# Altium schematic sheet MCU.SchDoc: MK1 MCU
size A3; Author: Mikkel Nielsen; DrawnBy: Mikkel Nielsen; Engineer: Mikkel Nielsen; SheetNumber: 2; SheetTotal: 7
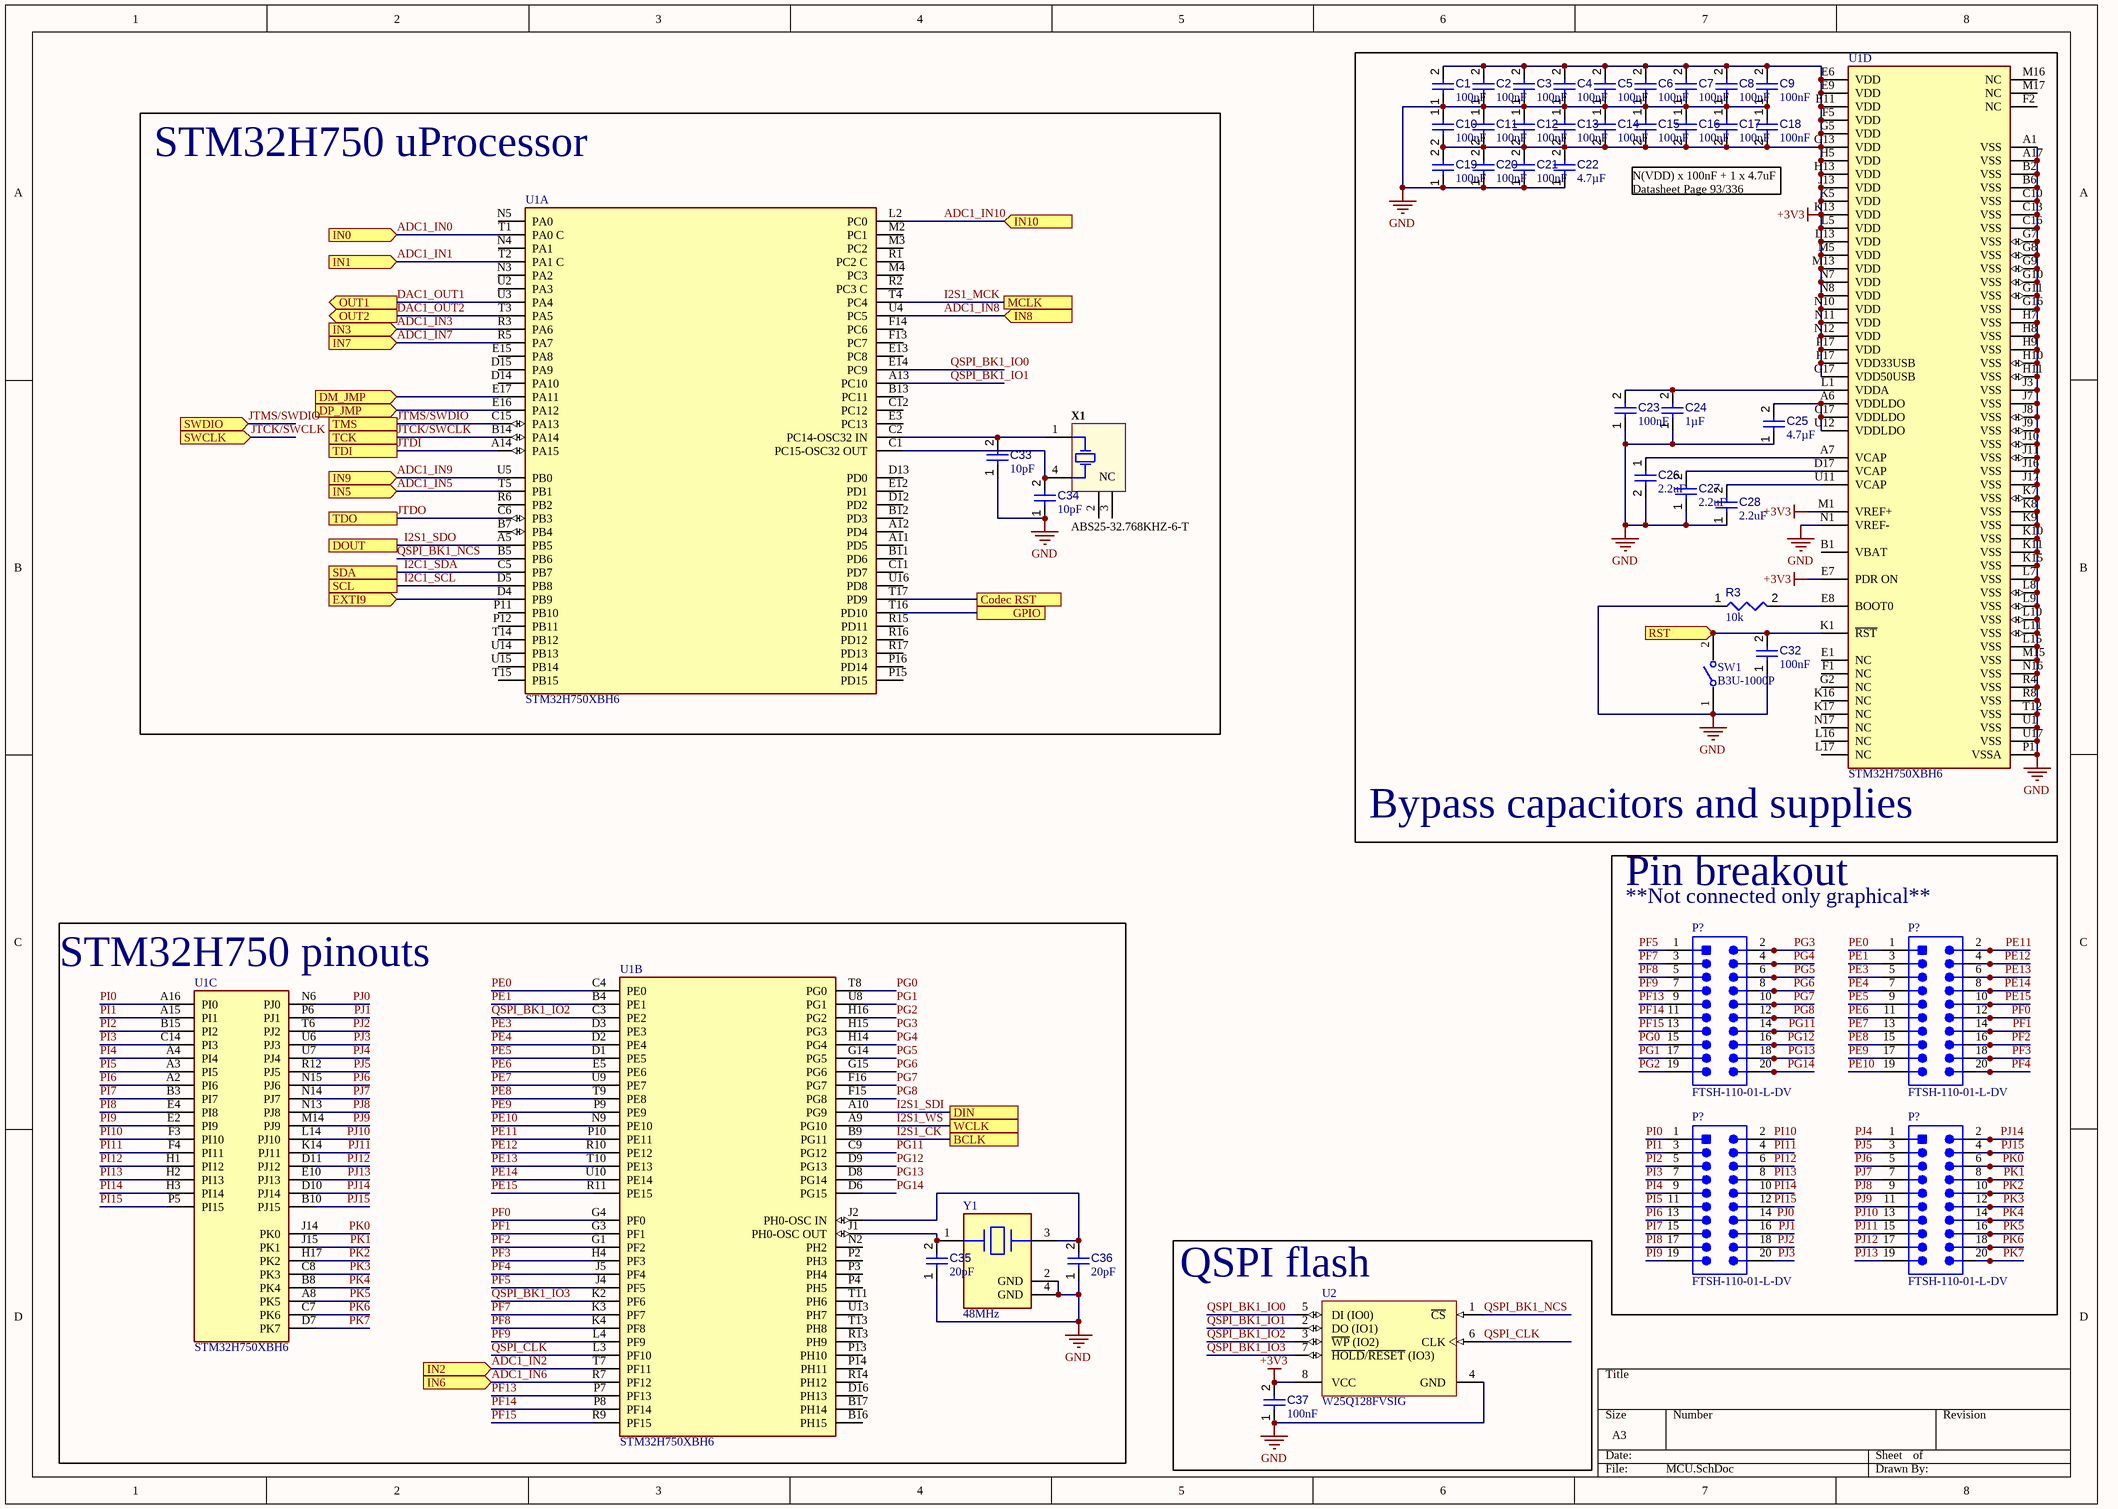
[diagram p0: MCU.SchDoc]

## Parts
(Parts that share a designator on the sheet are numbered #1, #2 ... from top to bottom, then left to right.)
C1  value 100nF  [CAPC0603(1608)100_L]  (hidden comment: Capacitor 470nF +/-20% 25V 0603)
C2  value 100nF  [CAPC0603(1608)100_L]  (hidden comment: Capacitor 470nF +/-20% 25V 0603)
C3  value 100nF  [CAPC0603(1608)100_L]  (hidden comment: Capacitor 470nF +/-20% 25V 0603)
C4  value 100nF  [CAPC0603(1608)100_L]  (hidden comment: Capacitor 470nF +/-20% 25V 0603)
C5  value 100nF  [CAPC0603(1608)100_L]  (hidden comment: Capacitor 470nF +/-20% 25V 0603)
C6  value 100nF  [CAPC0603(1608)100_L]  (hidden comment: Capacitor 470nF +/-20% 25V 0603)
C7  value 100nF  [CAPC0603(1608)100_L]  (hidden comment: Capacitor 470nF +/-20% 25V 0603)
C8  value 100nF  [CAPC0603(1608)100_L]  (hidden comment: Capacitor 470nF +/-20% 25V 0603)
C9  value 100nF  [CAPC0603(1608)100_L]  (hidden comment: Capacitor 470nF +/-20% 25V 0603)
C10  value 100nF  [CAPC0603(1608)100_L]  (hidden comment: Capacitor 470nF +/-20% 25V 0603)
C11  value 100nF  [CAPC0603(1608)100_L]  (hidden comment: Capacitor 470nF +/-20% 25V 0603)
C12  value 100nF  [CAPC0603(1608)100_L]  (hidden comment: Capacitor 470nF +/-20% 25V 0603)
C13  value 100nF  [CAPC0603(1608)100_L]  (hidden comment: Capacitor 470nF +/-20% 25V 0603)
C14  value 100nF  [CAPC0603(1608)100_L]  (hidden comment: Capacitor 470nF +/-20% 25V 0603)
C15  value 100nF  [CAPC0603(1608)100_L]  (hidden comment: Capacitor 470nF +/-20% 25V 0603)
C16  value 100nF  [CAPC0603(1608)100_L]  (hidden comment: Capacitor 470nF +/-20% 25V 0603)
C17  value 100nF  [CAPC0603(1608)100_L]  (hidden comment: Capacitor 470nF +/-20% 25V 0603)
C18  value 100nF  [CAPC0603(1608)100_L]  (hidden comment: Capacitor 470nF +/-20% 25V 0603)
C19  value 100nF  [CAPC0603(1608)100_L]  (hidden comment: Capacitor 470nF +/-20% 25V 0603)
C20  value 100nF  [CAPC0603(1608)100_L]  (hidden comment: Capacitor 470nF +/-20% 25V 0603)
C21  value 100nF  [CAPC0603(1608)100_L]  (hidden comment: Capacitor 470nF +/-20% 25V 0603)
C22  value 4.7µF  [CAPC0603(1608)100_L]  (hidden comment: Capacitor 4.7µF +/-20% 10V 0603)
C23  value 100nF  [CAPC0603(1608)100_L]  (hidden comment: Capacitor 470nF +/-20% 25V 0603)
C24  value 1µF  [CAPC0603(1608)100_L]  (hidden comment: Capacitor 1µF +/-40% 50V 0603)
C25  value 4.7µF  [CAPC0603(1608)100_L]  (hidden comment: Capacitor 4.7µF +/-20% 10V 0603)
C26  value 2.2uF  [CAPC0603(1608)100_L]  (hidden comment: Capacitor 470nF +/-20% 25V 0603)
C27  value 2.2uF  [CAPC0603(1608)100_L]  (hidden comment: Capacitor 470nF +/-20% 25V 0603)
C28  value 2.2uF  [CAPC0603(1608)100_L]  (hidden comment: Capacitor 470nF +/-20% 25V 0603)
C32  value 100nF  [CAPC0603(1608)100_L]  (hidden comment: Capacitor 470nF +/-20% 25V 0603)
C33  value 10pF  [CAPC0603(1608)100_L]  (hidden comment: Capacitor 470nF +/-20% 25V 0603)
C34  value 10pF  [CAPC0603(1608)100_L]  (hidden comment: Capacitor 470nF +/-20% 25V 0603)
C35  value 20pF  [CAPC0603(1608)100_L]  (hidden comment: Capacitor 470nF +/-20% 25V 0603)
C36  value 20pF  [CAPC0603(1608)100_L]  (hidden comment: Capacitor 470nF +/-20% 25V 0603)
C37  value 100nF  [CAPC0603(1608)100_L]  (hidden comment: Capacitor 470nF +/-20% 25V 0603)
P?#1  FTSH-110-01-L-DV  [SMTC-FTSH-110-01-L-DV_V]  (graphical)
P?#2  FTSH-110-01-L-DV  [SMTC-FTSH-110-01-L-DV_V]  (graphical)
P?#3  FTSH-110-01-L-DV  [SMTC-FTSH-110-01-L-DV_V]  (graphical)
P?#4  FTSH-110-01-L-DV  [SMTC-FTSH-110-01-L-DV_V]  (graphical)
R3  value 10k  [RESC0603(1608)_L]  (hidden comment: 120R3J)
SW1  B3U-1000P  [FP-B3U-1000P-MFG]
U1  STM32H750XBH6  [FP-TFBGA2650-A07U-MFG]  (parts A,B,C,D of 4)
U2  W25Q128FVSIG  [WINB-SOIC-8_M]
X1  ABS25-32.768KHZ-6-T  [ABRA-ABS25-4_V]
Y1  48MHz  [FP-ABM3B-MFG]

## Blocks framed on the sheet
Bypass capacitors and supplies: C1-C28 C32 R3 SW1 U1
STM32H750 uProcessor: C33 C34 U1 X1
Pin breakout: P?#1-P?#4
STM32H750 pinouts: C35 C36 U1 Y1
QSPI flash: C37 U2

## Ports
BCLK, Codec RST, DIN, DM_JMP (in), DOUT, DP_JMP (in), EXTI9 (in), GPIO, IN0 (in), IN1 (in), IN2 (in), IN3 (in), IN5 (in), IN6 (in), IN7 (in), IN8 (in), IN9 (in), IN10 (in), MCLK, OUT1 (out), OUT2 (out), RST (in), SCL, SDA, SWCLK (in), SWDIO (in), TCK, TDI, TDO, TMS, WCLK

## Nets
+3V3: C1.2 C2.2 C3.2 C4.2 C5.2 C6.2 C7.2 C8.2 C9.2 C10.2 C11.2 C12.2 C13.2 C14.2 C15.2 C16.2 C17.2 C18.2 C19.2 C20.2 C21.2 C22.2 C37.2 U1.E6(VDD) U1.E7(PDR_ON) U1.E9(VDD) U1.E11(VDD) U1.F5(VDD) U1.F17(VDD33USB) U1.G5(VDD) U1.G13(VDD) U1.G17(VDD50USB) U1.H5(VDD) U1.H13(VDD) U1.J13(VDD) U1.K5(VDD) U1.K13(VDD) U1.L5(VDD) U1.L13(VDD) U1.M1(VREF+) U1.M5(VDD) U1.M13(VDD) U1.N7(VDD) U1.N8(VDD) U1.N10(VDD) U1.N11(VDD) U1.N12(VDD) U1.P17(VDD) U2.8(VCC)
GND: C1.1 C2.1 C3.1 C4.1 C5.1 C6.1 C7.1 C8.1 C9.1 C10.1 C11.1 C12.1 C13.1 C14.1 C15.1 C16.1 C17.1 C18.1 C19.1 C20.1 C21.1 C22.1 C23.1 C24.1 C25.1 C26.2 C27.1 C28.1 C32.1 C33.1 C34.1 C35.1 C36.1 C37.1 R3.1 SW1.1 U1.A1(VSS) U1.A17(VSS) U1.B2(VSS) U1.B6(VSS) U1.C10(VSS) U1.C13(VSS) U1.C16(VSS) U1.G7(VSS) U1.G8(VSS) U1.G9(VSS) U1.G10(VSS) U1.G11(VSS) U1.G16(VSS) U1.H7(VSS) U1.H8(VSS) U1.H9(VSS) U1.H10(VSS) U1.H11(VSS) U1.J3(VSS) U1.J7(VSS) U1.J8(VSS) U1.J9(VSS) U1.J10(VSS) U1.J11(VSS) U1.J16(VSS) U1.J17(VSS) U1.K7(VSS) U1.K8(VSS) U1.K9(VSS) U1.K10(VSS) U1.K11(VSS) U1.K15(VSS) U1.L7(VSS) U1.L8(VSS) U1.L9(VSS) U1.L10(VSS) U1.L11(VSS) U1.L15(VSS) U1.M15(VSS) U1.N1(VREF-) U1.N16(VSS) U1.P1(VSSA) U1.R4(VSS) U1.R8(VSS) U1.T12(VSS) U1.U1(VSS) U1.U17(VSS) U2.4(GND) Y1.2(GND) Y1.4(GND)
ADC1_IN0: U1.T1(PA0_C) ; port IN0
ADC1_IN1: U1.T2(PA1_C) ; port IN1
ADC1_IN2: U1.T7(PF11) ; port IN2
ADC1_IN3: U1.R3(PA6) ; port IN3
ADC1_IN5: U1.T5(PB1) ; port IN5
ADC1_IN6: U1.R7(PF12) ; port IN6
ADC1_IN7: U1.R5(PA7) ; port IN7
ADC1_IN8: U1.U4(PC5) ; port IN8
ADC1_IN9: U1.U5(PB0) ; port IN9
ADC1_IN10: U1.L2(PC0) ; port IN10
Codec RST: U1.T17(PD9) ; port Codec RST
DAC1_OUT1: U1.U3(PA4) ; port OUT1
DAC1_OUT2: U1.T3(PA5) ; port OUT2
DM_JMP: U1.E17(PA11) ; port DM_JMP
DP_JMP: U1.E16(PA12) ; port DP_JMP
EXTI9: U1.D4(PB9) ; port EXTI9
GPIO: U1.T16(PD10) ; port GPIO
I2C1_SCL: U1.D5(PB8) ; port SCL
I2C1_SDA: U1.C5(PB7) ; port SDA
I2S1_CK: U1.B9(PG11) ; port BCLK
I2S1_MCK: U1.T4(PC4) ; port MCLK
I2S1_SDI: U1.A10(PG9) ; port DIN
I2S1_SDO: U1.A5(PB5) ; port DOUT
I2S1_WS: U1.A9(PG10) ; port WCLK
JTCK/SWCLK: U1.B14(PA14) ; port TCK, port SWCLK
JTDI: U1.A14(PA15) ; port TDI
JTDO: U1.C6(PB3) ; port TDO
JTMS/SWDIO: U1.C15(PA13) ; port TMS, port SWDIO
PE0: P?#2.1 U1.C4(PE0)
PE1: P?#2.3 U1.B4(PE1)
PE3: P?#2.5 U1.D3(PE3)
PE4: P?#2.7 U1.D2(PE4)
PE5: P?#2.9 U1.D1(PE5)
PE6: P?#2.11 U1.E5(PE6)
PE7: P?#2.13 U1.U9(PE7)
PE8: P?#2.15 U1.T9(PE8)
PE9: P?#2.17 U1.P9(PE9)
PE10: P?#2.19 U1.N9(PE10)
PE11: P?#2.2 U1.P10(PE11)
PE12: P?#2.4 U1.R10(PE12)
PE13: P?#2.6 U1.T10(PE13)
PE14: P?#2.8 U1.U10(PE14)
PE15: P?#2.10 U1.R11(PE15)
PF0: P?#2.12 U1.G4(PF0)
PF1: P?#2.14 U1.G3(PF1)
PF2: P?#2.16 U1.G1(PF2)
PF3: P?#2.18 U1.H4(PF3)
PF4: P?#2.20 U1.J5(PF4)
PF5: P?#1.1 U1.J4(PF5)
PF7: P?#1.3 U1.K3(PF7)
PF8: P?#1.5 U1.K4(PF8)
PF9: P?#1.7 U1.L4(PF9)
PF13: P?#1.9 U1.P7(PF13)
PF14: P?#1.11 U1.P8(PF14)
PF15: P?#1.13 U1.R9(PF15)
PG0: P?#1.15 U1.T8(PG0)
PG1: P?#1.17 U1.U8(PG1)
PG2: P?#1.19 U1.H16(PG2)
PG3: P?#1.2 U1.H15(PG3)
PG4: P?#1.4 U1.H14(PG4)
PG5: P?#1.6 U1.G14(PG5)
PG6: P?#1.8 U1.G15(PG6)
PG7: P?#1.10 U1.F16(PG7)
PG8: P?#1.12 U1.F15(PG8)
PG11: P?#1.14 U1.C9(PG12)
PG12: P?#1.16 U1.D9(PG13)
PG13: P?#1.18 U1.D8(PG14)
PG14: P?#1.20 U1.D6(PG15)
PI0: P?#3.1 U1.A16(PI0)
PI1: P?#3.3 U1.A15(PI1)
PI2: P?#3.5 U1.B15(PI2)
PI3: P?#3.7 U1.C14(PI3)
PI4: P?#3.9 U1.A4(PI4)
PI5: P?#3.11 U1.A3(PI5)
PI6: P?#3.13 U1.A2(PI6)
PI7: P?#3.15 U1.B3(PI7)
PI8: P?#3.17 U1.E4(PI8)
PI9: P?#3.19 U1.E2(PI9)
PI10: P?#3.2 U1.F3(PI10)
PI11: P?#3.4 U1.F4(PI11)
PI12: P?#3.6 U1.H1(PI12)
PI13: P?#3.8 U1.H2(PI13)
PI14: P?#3.10 U1.H3(PI14)
PI15: P?#3.12 U1.P5(PI15)
PJ0: P?#3.14 U1.N6(PJ0)
PJ1: P?#3.16 U1.P6(PJ1)
PJ2: P?#3.18 U1.T6(PJ2)
PJ3: P?#3.20 U1.U6(PJ3)
PJ4: P?#4.1 U1.U7(PJ4)
PJ5: P?#4.3 U1.R12(PJ5)
PJ6: P?#4.5 U1.N15(PJ6)
PJ7: P?#4.7 U1.N14(PJ7)
PJ8: P?#4.9 U1.N13(PJ8)
PJ9: P?#4.11 U1.M14(PJ9)
PJ10: P?#4.13 U1.L14(PJ10)
PJ11: P?#4.15 U1.K14(PJ11)
PJ12: P?#4.17 U1.D11(PJ12)
PJ13: P?#4.19 U1.E10(PJ13)
PJ14: P?#4.2 U1.D10(PJ14)
PJ15: P?#4.4 U1.B10(PJ15)
PK0: P?#4.6 U1.J14(PK0)
PK1: P?#4.8 U1.J15(PK1)
PK2: P?#4.10 U1.H17(PK2)
PK3: P?#4.12 U1.C8(PK3)
PK4: P?#4.14 U1.B8(PK4)
PK5: P?#4.16 U1.A8(PK5)
PK6: P?#4.18 U1.C7(PK6)
PK7: P?#4.20 U1.D7(PK7)
QSPI_BK1_IO0: U1.E14(PC9) U2.5(DI_(IO0))
QSPI_BK1_IO1: U1.A13(PC10) U2.2(DO_(IO1))
QSPI_BK1_IO2: U1.C3(PE2) U2.3(~{WP}_(IO2))
QSPI_BK1_IO3: U1.K2(PF6) U2.7(~{HOLD}/~{RESET}_(IO3))
QSPI_BK1_NCS: U1.B5(PB6) U2.1(~{CS})
QSPI_CLK: U1.L3(PF10) U2.6(CLK)
RST: C32.2 SW1.2 U1.K1(~{RST}) ; port RST
NetC23_2: C23.2 C24.2 U1.L1(VDDA)
NetC25_2: C25.2 U1.A6(VDDLDO) U1.C17(VDDLDO) U1.U12(VDDLDO)
NetC26_1: C26.1 U1.A7(VCAP)
NetC27_2: C27.2 U1.D17(VCAP)
NetC28_2: C28.2 U1.U11(VCAP)
NetC33_2: C33.2 U1.C2(PC14-OSC32_IN) X1.1(X1)
NetC34_2: C34.2 U1.C1(PC15-OSC32_OUT) X1.4(X2)
NetC35_2: C35.2 U1.J1(PH0-OSC_OUT) Y1.1
NetC36_2: C36.2 U1.J2(PH0-OSC_IN) Y1.3
NetR3_2: R3.2 U1.E8(BOOT0)

Not connected (* = marked no-connect by the designer): U1 A11(PD5) A12(PD4) B1(VBAT) B7(PB4) B11(PD6) B12(PD3) B13(PC11) B16(PH15) B17(PH14) C11(PD7) C12(PC12) D12(PD2) D13(PD0) D14(PA10) D15(PA9) D16(PH13) E1(NC) E3(PC13) E12(PD1) E13(PC8) E15(PA8) F1(NC) F2(NC) F13(PC7) F14(PC6) G2(NC) K16(NC) K17(NC) L16(NC) L17(NC) M2(PC1) M3(PC2) M4(PC3) M16(NC) M17(NC) N2(PH2) N3(PA2) N4(PA1) N5(PA0) N17(NC) P2(PH3) P3(PH4) P4(PH5) P11(PB10) P12(PB11) P13(PH10) P14(PH11) P15(PD15) P16(PD14) R1(PC2_C) R2(PC3_C) R6(PB2) R13(PH9) R14(PH12) R15(PD11) R16(PD12) R17(PD13) T11(PH6) T13(PH8) T14(PB12) T15(PB15) U2(PA3) U13(PH7) U14(PB13) U15(PB14) U16(PD8); X1 2(NC) 3(NC)

## Notes on the sheet
- N(VDD) x 100nF + 1 x 4.7uF
  Datasheet Page 93/336
- (near P?#2) **Not connected only graphical**

## Library data of the parts
C1-C21 C23 C26-C28 C32-C37 = CMP-001-00077-3: Chip Capacitor, 470nF +/-20%, 25V, 0603, Thickness 1 mm; Tolerance: 10%; Max Operating Temperature: 85°C; Voltage Rating: 25V; Pins: 2; Case/Package: 0603; Mounting Technology: SMT; Min Operating Temperature: -55°C
C22 C25 = CMP-001-00076-4: Chip Capacitor, 4.7µF +/-20%, 10V, 0603, Thickness 1 mm; Tolerance: 10%; Mounting Technology: SMT; Case/Package: 0603; Pins: 2; Min Operating Temperature: -55°C; Max Operating Temperature: 85°C; Voltage Rating: 10V
C24 = CMP-001-00078-4: Chip Capacitor, 1µF +/-40%, 50V, 0603, Thickness 1 mm; Tolerance: 10%; Case/Package: 0603; Pins: 2; Max Operating Temperature: 85°C; Voltage Rating: 50V; Mounting Technology: SMT; Min Operating Temperature: -55°C
P?#1-P?#4 = CMP-2000-06294-2: Male Header, Pitch 1.27 mm, 2 x 10 Position, Height 6.1 mm, -55 to 125 degC, RoHS, Tube; Manufacturer: Samtec; Online Catalog: FTSHSeries; Row Spacing: 0.050"(1.27mm); Number of Positions Loaded: All; Connector Type: Header,Unshrouded; Product Training Modules: Board-to-BoardConnectors; Featured Product: Board-To-BoardInterconnectSystems; Other Names: SAM1161-10; Mating Products: SAM9021-ND-CONNRECEPT20POS.50"SMTFLE-110-01-G-DV-TR-ND-CONNSKT1.27MM20POSDUALSMDFLE-110-01-G-DV-K-TR-ND-CONNSKT1.27MM20POSDUALSMDFLE-110-01-G-DV-A-K-TR-ND-CONNSKT1.27MM20POSDUALSMDSFMC-110-L2-S-D-P-TR-ND-CONN.05"SURFACE20POSSMTSAM1153-10-ND-CONNRCPT20POSDUAL.05"SMDSAM1155-10-ND-CONNRCPT20POSDUAL.05"SMDSAM1154-10-ND-CONNRCPT20POSDUAL.05"SMDSFMC-110-L3-S-D-ND-CONN.05"SURFACE20POSSTRAIGHTSFMC-110-02-S-D-ND-CONN.05"SURFACE20POSSMTSAM1226-10-ND-CONNRCPT.05"20POSDUALSMD; EDA / CAD Models: DownloadfromAcceleratedDesigns; Number of Positions: 20; Catalog Drawings: FTSHSeriesFTSHSeriesSMTSide; Package Reference: FTSH-110-01-L-DV; Family: RectangularConnectors-Headers,MalePins; Mounting Technology: SurfaceMount; Contact Type: MalePin; Manufacturer URL: http://www.samtec.com/; Package URL: http://suddendocs.samtec.com/prints/ftsh-1xx-xx-xxx-dv-xxx-xxx-mkt.pdf; Package Description: Male Header, Pitch 1.27 mm, 2 x 10 Position, Height 6.1 mm; Packaging: Bulk; Termination: Solder; Category: Connectors,Interconnects; Fastening Type: -; Datasheet Version: F-215 , 02/2016; Contact Finish Thickness: 10µin(0.25µm); Number of Rows: 2; Datasheet URL: http://suddendocs.samtec.com/catalog_english/ftsh_smt.pdf; Mounting Type: SurfaceMount; Series: FTSH; Features: -; Contact Finish: Gold; Standard Package: 1; Color: Black; Pitch: 0.050"(1.27mm); Contact Mating Length: 0.120"(3.05mm)
R3 = CMP-009-00069-2: 120R 0.1W 5% 0603 (1608 Metric)  SMD; Power: 100mW; Mounting Technology: SMT; Tolerance: 5%; Case/Package: 0603; Pins: 2
SW1 = CMP-2100-03586-2: SWITCH TACTILE SPST-NO 0.05A 12V; Contact Resistance: 100mR; Operating Force: 1.5N; Max Current Rating: 50mA; Switch Travel: 0.15mm; Actuator Type: Standard; Mechanical Life: 200000Cycles; Ratings: Dust Proof; Illumination Type: Non-Illuminated; Throw Configuration: SPST; Actuator Length: 0.4mm; Switch Function: Off-Mom; Height: 1.2mm; Width: 3mm; Weight: 0.000776oz; Contact Material: Silver; Max Voltage Rating (DC): 12V; Insulation Resistance: 100MR; Lead Free: Lead Free; Current Rating: 50mA; Termination: SMD/SMT; Length: 4mm; Voltage Rating (DC): 12V; Contact Current Rating: 50mA; Orientation: Straight; Depth: 2.5mm; Max Operating Temperature: 70°C; Packaging: Tape and Reel; Min Operating Temperature: -25°C; Package Quantity: 1; Mount: Surface Mount; Electrical Life: 200000Cycles
U1 = CMP-12105-000062-1: IC MCU 32BIT 128KB FLASH TFBGA; Manufacturer: STMicroelectronics; Number Of Cores: 1; Ram Size: 1MBytes; Interface: I2C,SPI,UART,USART,CAN,USB,LIN,IrDA,Ethernet,I2S; Number Of Timers/Counters: 10; Number Of Pwm Channels: 2; Core Architecture: ARM Cortex-M7; Frequency: 400MHz; Number Of Spi Channels: 6; Number Of Uart Channels: 9; Min Supply Voltage: 1.62V; Max Junction Temp: +125°C; Standoff Height: 0.15mm; Memory Size: 128KBytes; Nominal Supply Current: 24-348mA; Max Supply Voltage: 3.6V; Data Bus Width: 32bits; Number Of I2C Channels: 4; Number Of Adc Channels: 36; Number Of I/Os: 168; Number Of A/D Converters: 3; RoHS: TRUE; Package: TFBGA2650-A07U; Ambient Temperature Range Low: -40°C; Temperature Range High: +125°C; ComponentLink2Description: Datasheet; Number Of Usb Channels: 1; Device Class L2: Embedded Processors and Controllers; Automotive: No; Ambient Temperature Range High: +85°C; Octopart: https://octopart.com/stm32h750xbh6-stmicroelectronics-93259822; Lead Free: Yes; Ipc Land Pattern Name: BGA289N80P17X17_1400X1400X110; Manufacturer Part Number: STM32H750XBH6; Device Class L1: Integrated Circuits (ICs); Temperature: -40°C to +125°C; Device Class L3: Microcontrollers; ComponentLink2URL: https://www.st.com/resource/en/datasheet/stm32h750xb.pdf; Temperature Range Low: -40°C; Digikey Description: IC MCU 32BIT 128KB FLASH TFBGA; Number Of Ethernet Channels: 1; Height: 1.1mm; Category: IC; Memory Type: FLASH
U2 = CMP-2000-05005-1: 3V 128M-Bit Serial Flash Memory with Dual/Quad SPI & QPI, 2.7 to 3.6 V, -40 to 85 degC, 8-Pin SOIC, RoHS, Tape and Reel; Manufacturer: Winbond; Number of Words: 16777216; Address Bus: 24b; Word Size: 8b; Boot Type: NotRequired; Supply Current: 20mA; Operating Supply Voltage (Max): 3.6V; Sync/Async: Synchronous; Rad Hardened: No; Interface Type: Serial(SPI); Access Time (Max): 7ns; Operating Supply Voltage (Min): 2.7V; Operating Supply Voltage (Typ): 3/3.3V; Programmable: Yes; Density: 134217728Bit; Cell Type: NOR; Package Description: 8-Pin Small Outline Integrated Circuit, Body 5.28 x 5.28 mm, Pitch 1.27 mm; Datasheet URL: http://download.siliconexpert.com/pdfs/2015/11/30/6/42/17/890/win_/manual/3w25q128fv20rev.l2008242015.pdf; Package Reference: SS-8; Package Type: SOICW; Datasheet Version: Rev. L, 08/2015; Manufacturer URL: http://www.winbond.com/hq/index.html?__locale=en; Pin Count: 8; Operating Temperature Classification: Industrial; Operating Temperature (Min): -40C; Program/Erase Volt (Typ): 2.7to3.6V; Operating Temperature (Max): 85C; Mounting: SurfaceMount; Operating Temp Range: -40Cto85C
X1 = CMP-2000-05036-1: Low Frequency Crystal, 32.768 KHz, 6 pF, +/- 20 ppm, -40 to 85 degC, 4-Pin SMD, RoHS, Tape and Reel; Manufacturer: Abracon; Tolerance: 20PPM; ESR: 50kOhms; Case Width: 3.8mm; Case Height: 2.5mm; Case Length: 8mm; Load Capacitance: 6pF; Operating Temperature Range: -40Cto+85C; Package Reference: ABS25; Factory Pack Quantity: 3000; Package Description: 4-Pin Surface Mount Device, Body 8 x 3.8 mm, Pitch 5.5 mm; Frequency: 32.768kHz; Termination Style: SMD/SMT; Manufacturer URL: http://www.abracon.com/; Type: LowFrequencyCrystal; Dimensions: 3.8mmWx8mmLx2.5mmH; Product Category: Crystals; Series: ABS25; RoHS: Details; Package / Case: 8mmx3.8mm; Datasheet Version: Jun-17; Brand: ABRACON; Datasheet URL: https://datasheet.ciiva.com/854/abs25-854528.pdf; Packaging: Reel; Mounting Style: SMD/SMT
Y1 = CMP-27762-010589-1: Crystal 48MHz ±20ppm 18pF SMD-4 5mm x 3.2mm; Frequency Stability: 50ppm; Series Resistance: 50R; Package Quantity: 1000; Packaging: Tape and Reel; Frequency Tolerance: 20ppm; Depth: 3.2mm; Max Operating Temperature: 70°C; Lead Free: Lead Free; ESR (Equivalent Series Resistance): 50R; Operating Frequency: 48 MHz; REACH SVHC: No SVHC; Frequency: 48MHz; Length: 5mm; Min Operating Temperature: -20°C; Tolerance: 20ppm; Load Capacitance: 18pF; Case/Package: SMD/SMT; Series: ABM3B; Number of Pins: 4; Termination: SMD/SMT; Height: 0.043inch; Resistor Type: Ceramic; Mount: Surface Mount; Width: 3.2mm